# Altium schematic sheet LVDS_IFC.SchDoc: =TopTitle
size 420 x 297 mm; EDA_Number: ARTIQ; Projet: Zotino; CheckedBy: -; Author: G.Kasprowicz; CompanyName: WUT ISE; DrawnBy: G.Kasprowicz; Organization: WUT ISE; Address1: PW ISE; Address2: Nowowiejska 15/19 00-665 Warsaw; Address3: gkasprow@gmail.com; SheetNumber: -; SheetTotal: -; ModifiedBy: -; CheckedDate: -; Title2: LVDS_IFC; DivGrp: WUT ISE; Designer: G.Kasprowicz; ModifiedDate: -; ProjectName: Sensor Box
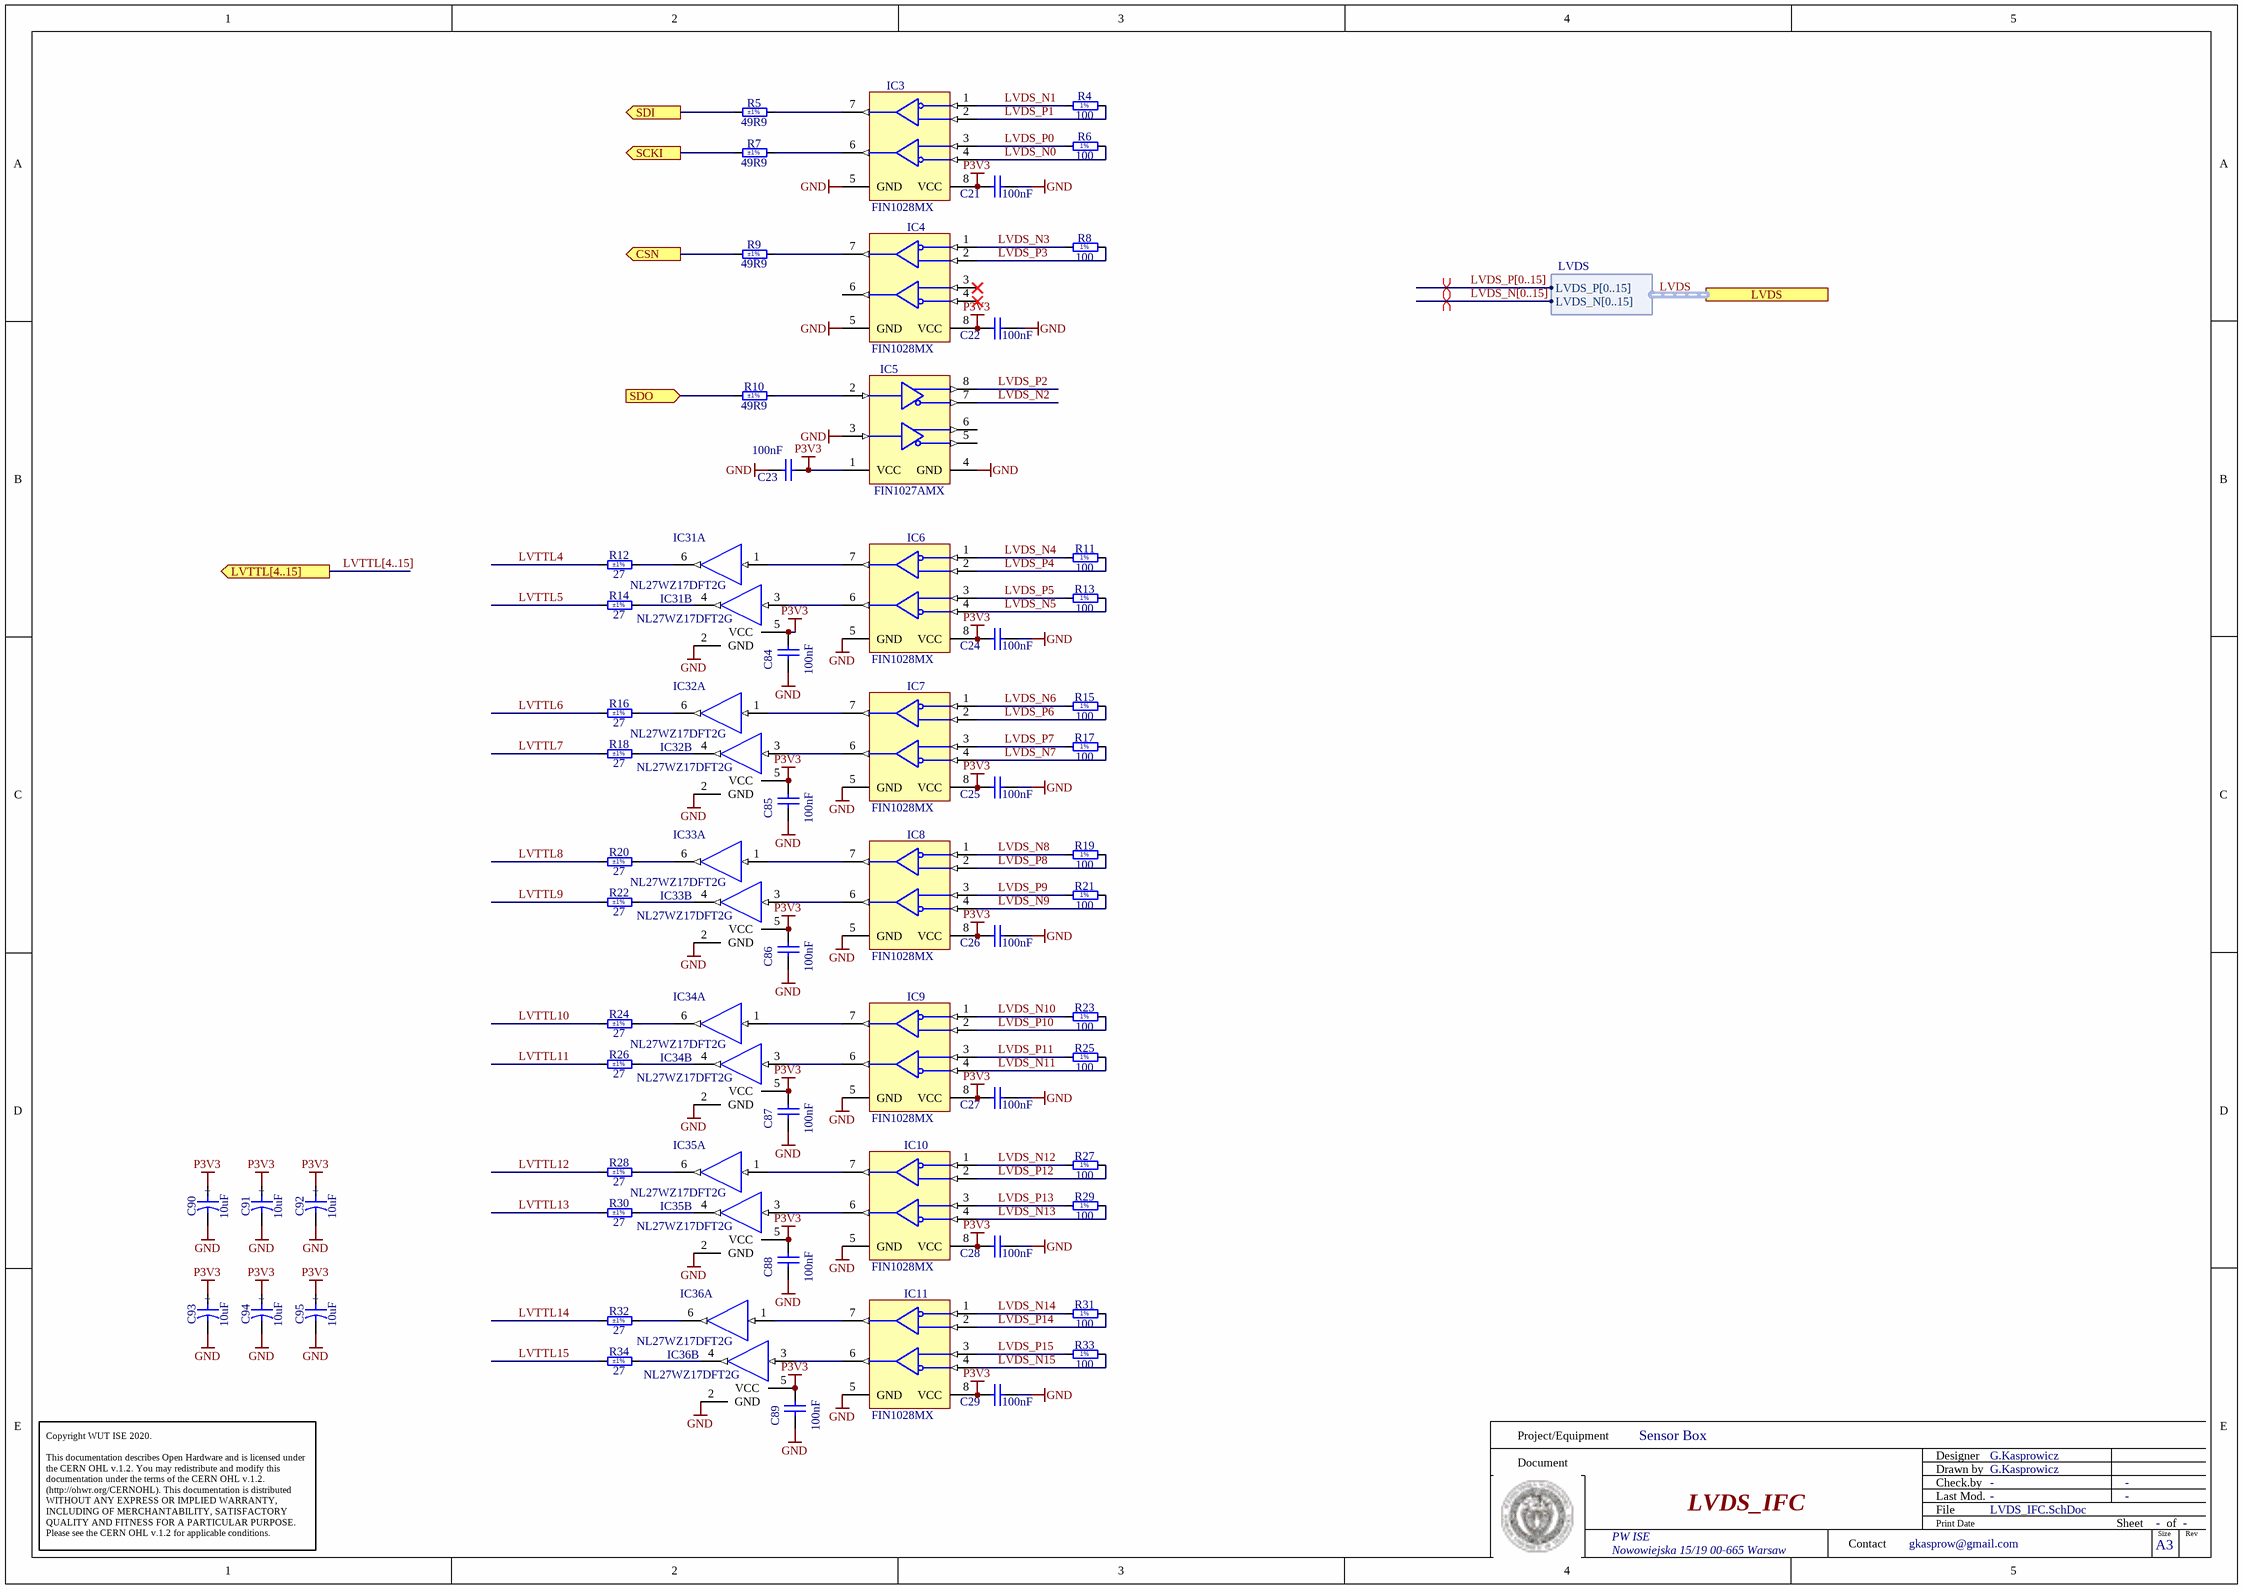
[diagram p0: LVDS_IFC.SchDoc]

## Parts
C21  100nF  [CAPC1005X55N]
C22  100nF  [CAPC1005X55N]
C23  100nF  [CAPC1005X55N]
C24  100nF  [CAPC1005X55N]
C25  100nF  [CAPC1005X55N]
C26  100nF  [CAPC1005X55N]
C27  100nF  [CAPC1005X55N]
C28  100nF  [CAPC1005X55N]
C29  100nF  [CAPC1005X55N]
C84  100nF  [CAPC1005X55N]
C85  100nF  [CAPC1005X55N]
C86  100nF  [CAPC1005X55N]
C87  100nF  [CAPC1005X55N]
C88  100nF  [CAPC1005X55N]
C89  100nF  [CAPC1005X55N]
C90  10uF  [CAPMP3216X180N]
C91  10uF  [CAPMP3216X180N]
C92  10uF  [CAPMP3216X180N]
C93  10uF  [CAPMP3216X180N]
C94  10uF  [CAPMP3216X180N]
C95  10uF  [CAPMP3216X180N]
IC3  FIN1028MX  [SOIC127P600X175-8N]
IC4  FIN1028MX  [SOIC127P600X175-8N]
IC5  FIN1027AMX  [SOIC127P600X175-8N]
IC6  FIN1028MX  [SOIC127P600X175-8N]
IC7  FIN1028MX  [SOIC127P600X175-8N]
IC8  FIN1028MX  [SOIC127P600X175-8N]
IC9  FIN1028MX  [SOIC127P600X175-8N]
IC10  FIN1028MX  [SOIC127P600X175-8N]
IC11  FIN1028MX  [SOIC127P600X175-8N]
IC31  NL27WZ17DFT2G  [SOT65P210X110-6N]  (parts A,B of 2)
IC32  NL27WZ17DFT2G  [SOT65P210X110-6N]  (parts A,B of 2)
IC33  NL27WZ17DFT2G  [SOT65P210X110-6N]  (parts A,B of 2)
IC34  NL27WZ17DFT2G  [SOT65P210X110-6N]  (parts A,B of 2)
IC35  NL27WZ17DFT2G  [SOT65P210X110-6N]  (parts A,B of 2)
IC36  NL27WZ17DFT2G  [SOT65P210X110-6N]  (parts A,B of 2)
R4  100  [RESC1005X40N]
R5  49R9  Tolerance: ±1%  [RESC1005X40N]
R6  100  [RESC1005X40N]
R7  49R9  Tolerance: ±1%  [RESC1005X40N]
R8  100  [RESC1005X40N]
R9  49R9  Tolerance: ±1%  [RESC1005X40N]
R10  49R9  Tolerance: ±1%  [RESC1005X40N]
R11  100  [RESC1005X40N]
R12  27  Tolerance: ±1%  [RESC1005X40N]
R13  100  [RESC1005X40N]
R14  27  Tolerance: ±1%  [RESC1005X40N]
R15  100  [RESC1005X40N]
R16  27  Tolerance: ±1%  [RESC1005X40N]
R17  100  [RESC1005X40N]
R18  27  Tolerance: ±1%  [RESC1005X40N]
R19  100  [RESC1005X40N]
R20  27  Tolerance: ±1%  [RESC1005X40N]
R21  100  [RESC1005X40N]
R22  27  Tolerance: ±1%  [RESC1005X40N]
R23  100  [RESC1005X40N]
R24  27  Tolerance: ±1%  [RESC1005X40N]
R25  100  [RESC1005X40N]
R26  27  Tolerance: ±1%  [RESC1005X40N]
R27  100  [RESC1005X40N]
R28  27  Tolerance: ±1%  [RESC1005X40N]
R29  100  [RESC1005X40N]
R30  27  Tolerance: ±1%  [RESC1005X40N]
R31  100  [RESC1005X40N]
R32  27  Tolerance: ±1%  [RESC1005X40N]
R33  100  [RESC1005X40N]
R34  27  Tolerance: ±1%  [RESC1005X40N]

## Ports
CSN (out), LVDS (harness LVDS), LVTTL[4..15] (out), SCKI (out), SDI (out), SDO (in)

## Harnesses
LVDS: LVDS_P[0..15], LVDS_N[0..15]

## Nets
GND: C21.1 C22.1 C23.1 C24.1 C25.1 C26.1 C27.1 C28.1 C29.1 C84.1 C85.1 C86.1 C87.1 C88.1 C89.1 C90.2 C91.2 C92.2 C93.2 C94.2 C95.2 IC3.5(GND) IC4.5(GND) IC5.3(DIN2RIN-) IC5.4(GND) IC6.5(GND) IC7.5(GND) IC8.5(GND) IC9.5(GND) IC10.5(GND) IC11.5(GND) IC31.2(GND) IC32.2(GND) IC33.2(GND) IC34.2(GND) IC35.2(GND) IC36.2(GND)
P3V3: C21.2 C22.2 C23.2 C24.2 C25.2 C26.2 C27.2 C28.2 C29.2 C84.2 C85.2 C86.2 C87.2 C88.2 C89.2 C90.1 C91.1 C92.1 C93.1 C94.1 C95.1 IC3.8(VCC) IC4.8(VCC) IC5.1(VCC) IC6.8(VCC) IC7.8(VCC) IC8.8(VCC) IC9.8(VCC) IC10.8(VCC) IC11.8(VCC) IC31.5(VCC) IC32.5(VCC) IC33.5(VCC) IC34.5(VCC) IC35.5(VCC) IC36.5(VCC)
VDD: IC31.5(VCC) IC32.5(VCC) IC33.5(VCC) IC34.5(VCC) IC35.5(VCC) IC36.5(VCC)
CSN: R9.1 ; port CSN
LVDS_N0: IC3.4(RIN2-) R6.2
LVDS_N1: IC3.1(RIN1-) R4.1
LVDS_N2: IC5.7(DOUT-)
LVDS_N3: IC4.1(RIN1-) R8.1
LVDS_N4: IC6.1(RIN1-) R11.1
LVDS_N5: IC6.4(RIN2-) R13.2
LVDS_N6: IC7.1(RIN1-) R15.1
LVDS_N7: IC7.4(RIN2-) R17.2
LVDS_N8: IC8.1(RIN1-) R19.1
LVDS_N9: IC8.4(RIN2-) R21.2
LVDS_N10: IC9.1(RIN1-) R23.1
LVDS_N11: IC9.4(RIN2-) R25.2
LVDS_N12: IC10.1(RIN1-) R27.1
LVDS_N13: IC10.4(RIN2-) R29.2
LVDS_N14: IC11.1(RIN1-) R31.1
LVDS_N15: IC11.4(RIN2-) R33.2
LVDS_P0: IC3.3(RIN2+) R6.1
LVDS_P1: IC3.2(RIN1+) R4.2
LVDS_P2: IC5.8(DOUT+)
LVDS_P3: IC4.2(RIN1+) R8.2
LVDS_P4: IC6.2(RIN1+) R11.2
LVDS_P5: IC6.3(RIN2+) R13.1
LVDS_P6: IC7.2(RIN1+) R15.2
LVDS_P7: IC7.3(RIN2+) R17.1
LVDS_P8: IC8.2(RIN1+) R19.2
LVDS_P9: IC8.3(RIN2+) R21.1
LVDS_P10: IC9.2(RIN1+) R23.2
LVDS_P11: IC9.3(RIN2+) R25.1
LVDS_P12: IC10.2(RIN1+) R27.2
LVDS_P13: IC10.3(RIN2+) R29.1
LVDS_P14: IC11.2(RIN1+) R31.2
LVDS_P15: IC11.3(RIN2+) R33.1
LVTTL4: R12.1
LVTTL5: R14.1
LVTTL6: R16.1
LVTTL7: R18.1
LVTTL8: R20.1
LVTTL9: R22.1
LVTTL10: R24.1
LVTTL11: R26.1
LVTTL12: R28.1
LVTTL13: R30.1
LVTTL14: R32.1
LVTTL15: R34.1
SCKI: R7.1 ; port SCKI
SDI: R5.1 ; port SDI
SDO: R10.1 ; port SDO
NetIC3_6: IC3.6(ROUT2) R7.2
NetIC3_7: IC3.7(ROUT1) R5.2
NetIC4_7: IC4.7(ROUT1) R9.2
NetIC5_2: IC5.2(DIN1) R10.2
NetIC6_6: IC6.6(ROUT2) IC31.3(IN)
NetIC6_7: IC6.7(ROUT1) IC31.1(IN)
NetIC7_6: IC7.6(ROUT2) IC32.3(IN)
NetIC7_7: IC7.7(ROUT1) IC32.1(IN)
NetIC8_6: IC8.6(ROUT2) IC33.3(IN)
NetIC8_7: IC8.7(ROUT1) IC33.1(IN)
NetIC9_6: IC9.6(ROUT2) IC34.3(IN)
NetIC9_7: IC9.7(ROUT1) IC34.1(IN)
NetIC10_6: IC10.6(ROUT2) IC35.3(IN)
NetIC10_7: IC10.7(ROUT1) IC35.1(IN)
NetIC11_6: IC11.6(ROUT2) IC36.3(IN)
NetIC11_7: IC11.7(ROUT1) IC36.1(IN)
NetIC31_4: IC31.4(OUT) R14.2
NetIC31_6: IC31.6(OUT) R12.2
NetIC32_4: IC32.4(OUT) R18.2
NetIC32_6: IC32.6(OUT) R16.2
NetIC33_4: IC33.4(OUT) R22.2
NetIC33_6: IC33.6(OUT) R20.2
NetIC34_4: IC34.4(OUT) R26.2
NetIC34_6: IC34.6(OUT) R24.2
NetIC35_4: IC35.4(OUT) R30.2
NetIC35_6: IC35.6(OUT) R28.2
NetIC36_4: IC36.4(OUT) R34.2
NetIC36_6: IC36.6(OUT) R32.2

Not connected (* = marked no-connect by the designer): IC4 3(RIN2+)* 4(RIN2-)* 6(ROUT2); IC5 5(DOUT-) 6(DOUT+)

## Buses and harness runs
bus LVDS_N[0..15]
bus LVDS_P[0..15]
bus LVTTL[4..15] = port LVTTL[4..15]
harness LVDS = port LVDS

## Layout directives
differential pair: (no net found under the mark)

## Notes on the sheet
- Project/Equipment
- Document
- Designer
- Drawn by
- Check.by
- Copyright WUT ISE 2020.
  This documentation describes Open Hardware and is licensed under the CERN OHL v.1.2. You may redistribute and modify this documentation under the terms of the CERN OHL v.1.2. (http://ohwr.org/CERNOHL). This documentation is distributed WITHOUT ANY EXPRESS OR IMPLIED WARRANTY, INCLUDING OF MERCHANTABILITY, SATISFACTORY QUALITY AND FITNESS FOR A PARTICULAR PURPOSE. Please see the CERN OHL v.1.2 for applicable conditions.
- Contact
- File
- Last Mod.
- Print Date
- Sheet
- Size
- A3
- of
- Rev
- (in symbol CTE3216-18_10UF_16V_20%_AVX_TCJ) +
- (in symbol R0402_100R_1%_0.0625W_100PPM) 1%

## Library data of the parts
C21-C29 C84-C89 = CC0402_100NF_16V_10%_X5R: Non-polarised capacitor; Part Description: SMD Multilayer Chip Ceramic Capacitor; Manufacturer: GENERIC; Manufacturer1 Part Number: GRM155R61C104KA88D; Voltage: 16V; TC: X5R; Tolerance: ±10%; Part Number: CC0402_100NF_16V_10%_X5R; Component Kind: Standard; Component Type: Standard; Pin Count: 2; Value: 100nF; Status: None; Manufacturer Part Number: CC0402_100NF_16V_10%_X5R; Case: 0402; Mounted: Yes; Socket: No; SMD: Yes; Sense: No; Manufacturer1 Example: MURATA; Manufacturer1 ComponentHeight: 0.55mm; HelpURL: \\cern.ch\dfs\Applications\Altium\Datasheets\CC0402_X5R_MURATA_GRM.pdf; Author: CERN DEM JLC; CreateDate: 10.12.2013; LatestRevisionDate: 10.12.2013
C90-C95 = CTE3216-18_10UF_16V_20%_AVX_TCJ: Polarised capacitor; Part Description: ESR 0R200 Tantalum Solid Electrolytic Chip Capacitor with Conductive Polymer Electrode; Manufacturer: AVX; Manufacturer Part Number: TCJA106M016R0200; Voltage: 16V; Tolerance: ±20%; Part Number: CTE3216-18_10UF_16V_20%_AVX_TCJ; Component Kind: Standard; Component Type: Standard; Pin Count: 2; Value: 10uF; Status: Preferred; Case: A; Mounted: Yes; Socket: No; SMD: Yes; Sense: No; ComponentHeight: 1.8mm; HelpURL: \\cern.ch\dfs\Applications\Altium\Datasheets\CTE_AVX_TCJ.pdf; Author: CERN DEM JLC; CreateDate: 29.03.2012; LatestRevisionDate: 29.03.2012
IC3 IC4 IC6-IC11 = IFC_FIN1028: 3.3V LVDS 2-Bit High-Speed Differential Reciever; Manufacturer: ON Semiconductor; PressFit: No; Bonding: No; Part Number: FIN1028MX; Component Kind: Standard; Component Type: Standard; Device: FIN1028MX; PackageDescription: SOIC 8, Pitch 1.27mm - Body 4x5mm, IPC Medium Density; Part Description: 3.3V LVDS 2-Bit High-Speed Differential Reciever; Manufacturer Part Number: FIN1028MX; Pin Count: 8; Case: SOIC8; Mounted: Yes; Socket: No; SMD: Yes; Sense: No; ComponentHeight: 0.8mm; Author: GK; HelpURL: \\cern.ch\dfs\Applications\Altium\Datasheets\FIN1101K8X.pdf; CreateDate: 08/11/2016; LatestRevisionDate: 08/11/2016
IC5 = IFC_FIN1027A: 3.3V LVDS, 2-Bit, High-Speed, Differential Driver; Manufacturer: ON Semiconductor; PressFit: No; Bonding: No; Part Number: FIN1027AMX; Component Kind: Standard; Component Type: Standard; Device: FIN1027AMX; PackageDescription: SOIC 8, Pitch 1.27mm - Body 4x5mm, IPC Medium Density; Part Description: 3.3V LVDS, 2-Bit, High-Speed, Differential Driver; Manufacturer Part Number: FIN1027AMX; Pin Count: 8; Case: SOIC8; Mounted: Yes; Socket: No; SMD: Yes; Sense: No; ComponentHeight: 0.8mm; Author: GK; HelpURL: \\cern.ch\dfs\Applications\Altium\Datasheets\FIN1101K8X.pdf; CreateDate: 08/11/2016; LatestRevisionDate: 08/11/2016
IC31-IC36 = NL27WZ17DFT2G: Dual Schmitt Trigger Buffer, Non-Inverting; Manufacturer: ON SEMICONDUCTOR; PressFit: No; Bonding: No; Part Number: NL27WZ17DFT2G; Component Kind: Standard; Component Type: Standard; Device: NL27WZ17DFT2G; PackageDescription: SOT363, SC-88, 0.65mm Pitch; 6 Pin, 1.25mm W X 2.00mm L X 1.10mm H body, IPC Medium Density; Part Description: Dual Schmitt Trigger Buffer, Non-Inverting; Manufacturer Part Number: NL27WZ17DF; Pin Count: 6; Case: SOT363; Mounted: Yes; Socket: No; SMD: Yes; Sense: No; ComponentHeight: 1.1mm; Author: CERN DEM BC; HelpURL: \\cern.ch\dfs\Applications\Altium\Datasheets\NL27WZ17DFT2G.pdf; CreateDate: 02.06.2020; LatestRevisionDate: 25.05.2022
R4 R6 R8 R11 R13 R15 R17 R19 R21 R23 R25 R27 R29 R31 R33 = R0402_100R_1%_0.0625W_100PPM: Resistor - 1%; Part Description: General Purpose Thick Film Chip Resistor; Manufacturer: GENERIC; Manufacturer1 Part Number: 232270671001L; TC: ±100ppm/°C; PressFit: No; Part Number: R0402_100R_1%_0.0625W_100PPM; Component Kind: Standard; Component Type: Standard; Pin Count: 2; Value: 100; Status: Not Recommended; Power: 0.0625W; Tolerance: ±1%; Manufacturer Part Number: R0402_100R_1%_0.0625W_100PPM; Case: 0402; Mounted: Yes; Sense: No; Socket: No; SMD: Yes; Manufacturer1 Example: YAGEO PHYCOMP; Manufacturer1 ComponentHeight: 0.4mm; HelpURL: \\cern.ch\dfs\Applications\Altium\Datasheets\R0402_Phycomp_RC0402.pdf; Author: CERN DEM JLC; CreateDate: 03.12.2007; LatestRevisionDate: 17.10.2012
R5 R7 R9 R10 = R0402_49R9_1%_0.0625W_100PPM: Resistor - 1%; Part Description: General Purpose Thick Film Chip Resistor; Manufacturer: GENERIC; Manufacturer1 Part Number: 232270674999L or RC0402FR-0749R9L; TC: ±100ppm/°C; PressFit: No; Part Number: R0402_49R9_1%_0.0625W_100PPM; Component Kind: Standard; Component Type: Standard; Pin Count: 2; Value: 49R9; Status: Not Recommended; Power: 0.0625W; Manufacturer Part Number: R0402_49R9_1%_0.0625W_100PPM; Case: 0402; Mounted: Yes; Sense: No; Socket: No; SMD: Yes; Manufacturer1 Example: YAGEO PHYCOMP; Manufacturer1 ComponentHeight: 0.4mm; HelpURL: \\cern.ch\dfs\Applications\Altium\Datasheets\R0402_Phycomp_RC0402.pdf; Author: CERN DEM JLC; CreateDate: 24.10.2012; LatestRevisionDate: 24.10.2012
R12 R14 R16 R18 R20 R22 R24 R26 R28 R30 R32 R34 = R0402_27R_1%_0.0625W_100PPM: Resistor - 1%; Part Description: General Purpose Thick Film Chip Resistor; Manufacturer: GENERIC; Manufacturer1 Part Number: 232270672709L; TC: ±100ppm/°C; PressFit: No; Part Number: R0402_27R_1%_0.0625W_100PPM; Component Kind: Standard; Component Type: Standard; Pin Count: 2; Value: 27; Status: Not Recommended; Power: 0.0625W; Manufacturer Part Number: R0402_27R_1%_0.0625W_100PPM; Case: 0402; Mounted: Yes; Sense: No; Socket: No; SMD: Yes; Manufacturer1 Example: YAGEO PHYCOMP; Manufacturer1 ComponentHeight: 0.4mm; HelpURL: \\cern.ch\dfs\Applications\Altium\Datasheets\R0402_Phycomp_RC0402.pdf; Author: CERN DEM JLC; CreateDate: 03.12.2007; LatestRevisionDate: 17.10.2012